# Altium schematic sheet fpga21-serdes-power.SchDoc
size Tabloid; SheetNumber: 50; SheetTotal: 71
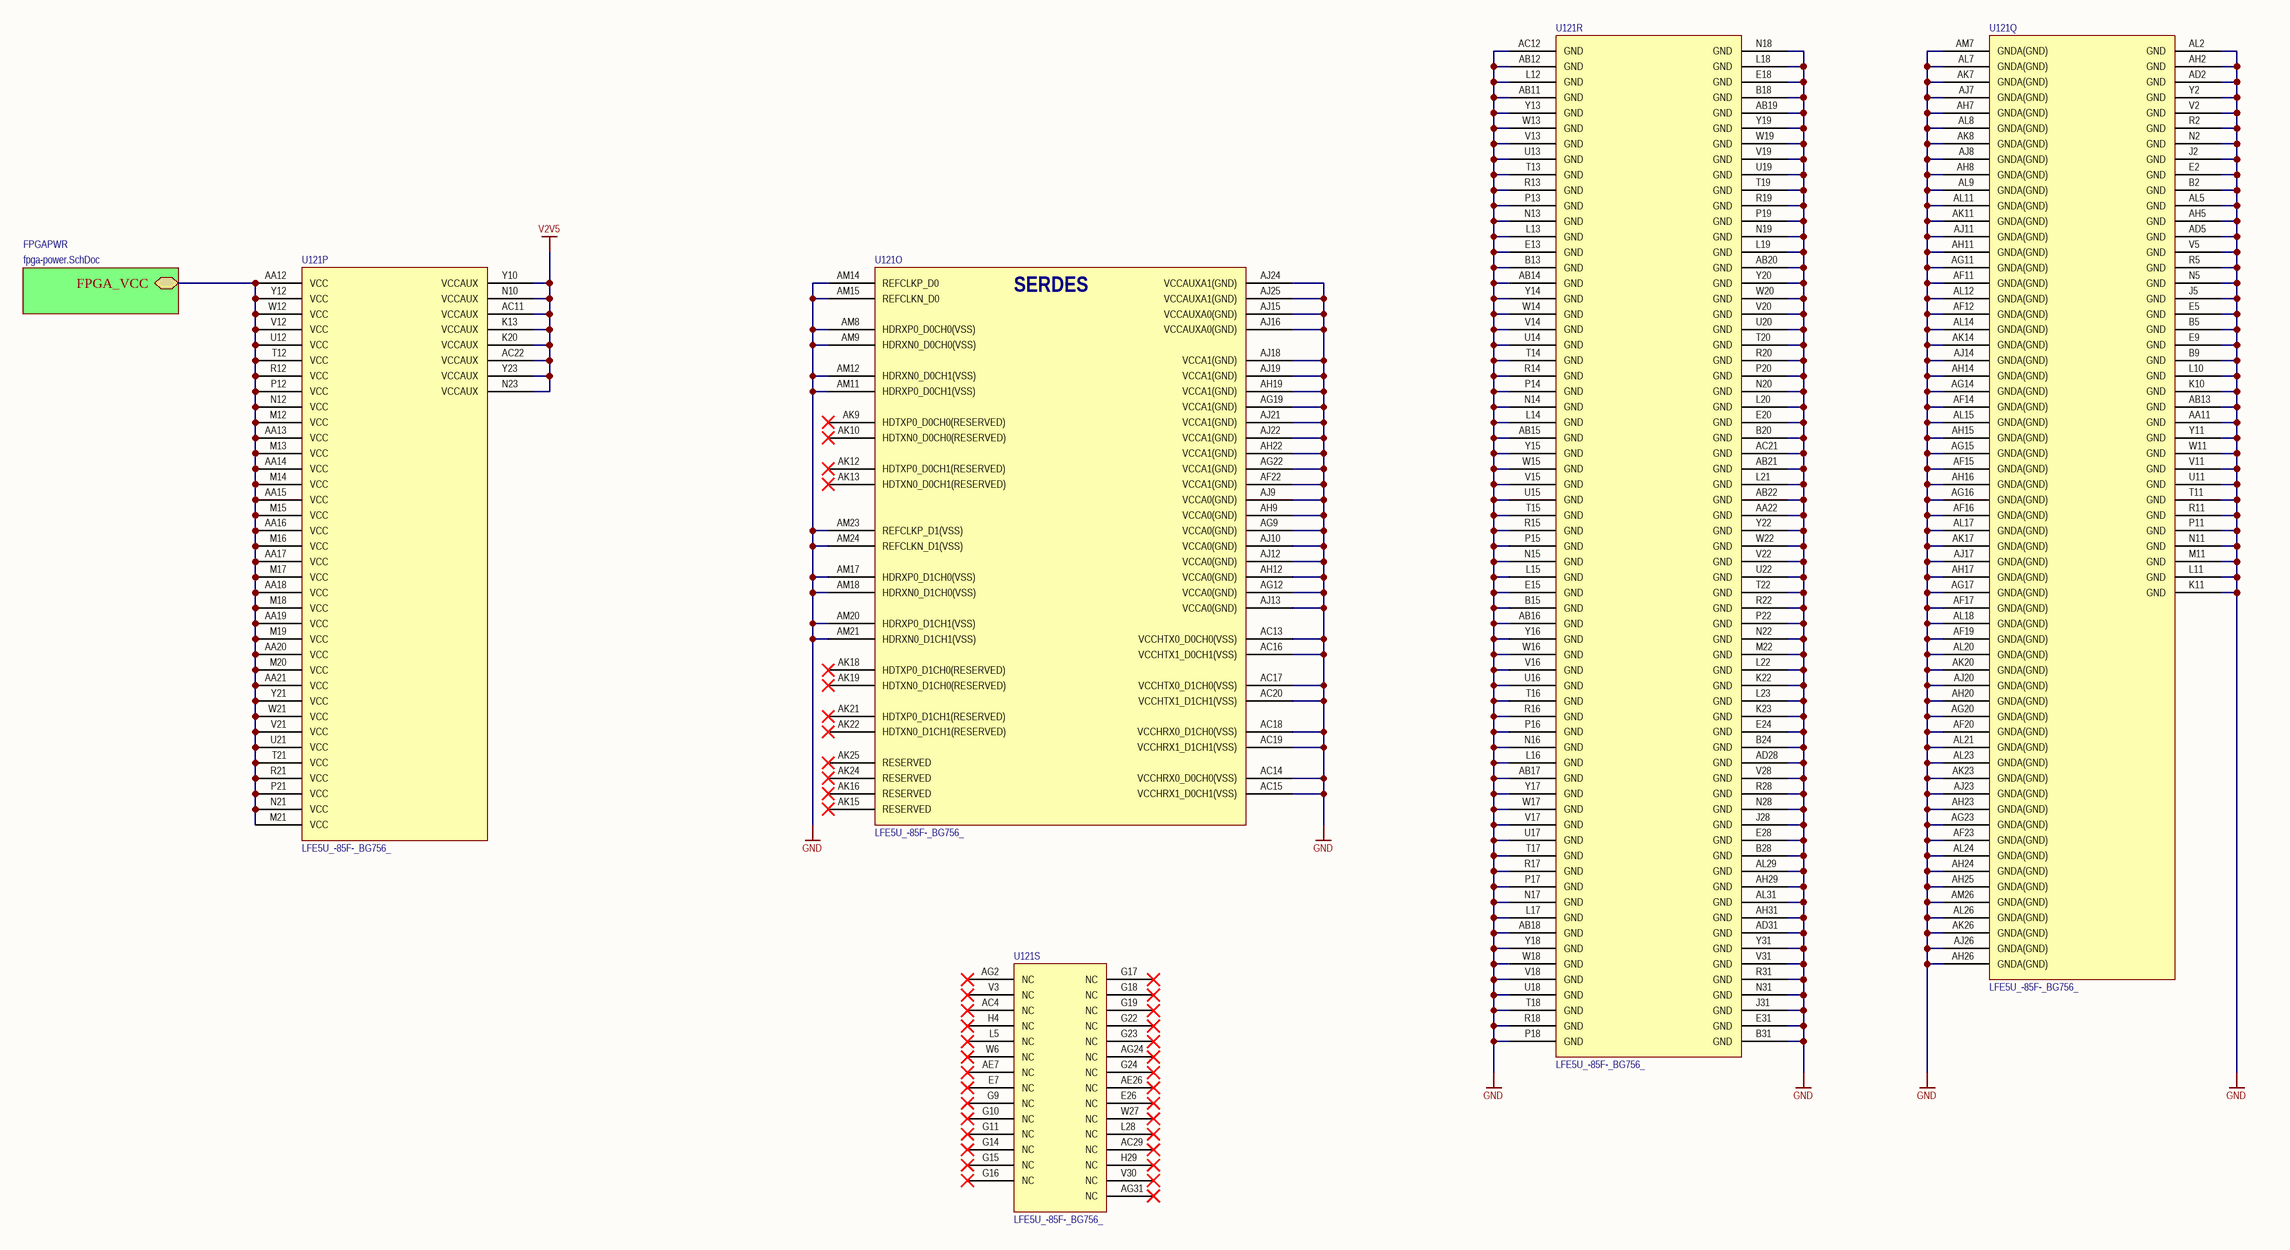
[diagram p0: fpga21-serdes-power.SchDoc]

## Parts
U121  LFE5U_-85F-_BG756_  [caBGA756]  (parts O,P,Q,R,S of 19)

## Sub-sheets
FPGAPWR = fpga-power.SchDoc: FPGA_VCC

## Nets
GND: U121.AA11(GND) U121.AA22(GND) U121.AB11(GND) U121.AB12(GND) U121.AB13(GND) U121.AB14(GND) U121.AB15(GND) U121.AB16(GND) U121.AB17(GND) U121.AB18(GND) U121.AB19(GND) U121.AB20(GND) U121.AB21(GND) U121.AB22(GND) U121.AC12(GND) U121.AC13(VCCHTX0_D0CH0(VSS)) U121.AC14(VCCHRX0_D0CH0(VSS)) U121.AC15(VCCHRX1_D0CH1(VSS)) U121.AC16(VCCHTX1_D0CH1(VSS)) U121.AC17(VCCHTX0_D1CH0(VSS)) U121.AC18(VCCHRX0_D1CH0(VSS)) U121.AC19(VCCHRX1_D1CH1(VSS)) U121.AC20(VCCHTX1_D1CH1(VSS)) U121.AC21(GND) U121.AD2(GND) U121.AD5(GND) U121.AD28(GND) U121.AD31(GND) U121.AF11(GNDA(GND)) U121.AF12(GNDA(GND)) U121.AF14(GNDA(GND)) U121.AF15(GNDA(GND)) U121.AF16(GNDA(GND)) U121.AF17(GNDA(GND)) U121.AF19(GNDA(GND)) U121.AF20(GNDA(GND)) U121.AF22(VCCA1(GND)) U121.AF23(GNDA(GND)) U121.AG9(VCCA0(GND)) U121.AG11(GNDA(GND)) U121.AG12(VCCA0(GND)) U121.AG14(GNDA(GND)) U121.AG15(GNDA(GND)) U121.AG16(GNDA(GND)) U121.AG17(GNDA(GND)) U121.AG19(VCCA1(GND)) U121.AG20(GNDA(GND)) U121.AG22(VCCA1(GND)) U121.AG23(GNDA(GND)) U121.AH2(GND) U121.AH5(GND) U121.AH7(GNDA(GND)) U121.AH8(GNDA(GND)) U121.AH9(VCCA0(GND)) U121.AH11(GNDA(GND)) U121.AH12(VCCA0(GND)) U121.AH14(GNDA(GND)) U121.AH15(GNDA(GND)) U121.AH16(GNDA(GND)) U121.AH17(GNDA(GND)) U121.AH19(VCCA1(GND)) U121.AH20(GNDA(GND)) U121.AH22(VCCA1(GND)) U121.AH23(GNDA(GND)) U121.AH24(GNDA(GND)) U121.AH25(GNDA(GND)) U121.AH26(GNDA(GND)) U121.AH29(GND) U121.AH31(GND) U121.AJ7(GNDA(GND)) U121.AJ8(GNDA(GND)) U121.AJ9(VCCA0(GND)) U121.AJ10(VCCA0(GND)) U121.AJ11(GNDA(GND)) U121.AJ12(VCCA0(GND)) U121.AJ13(VCCA0(GND)) U121.AJ14(GNDA(GND)) U121.AJ15(VCCAUXA0(GND)) U121.AJ16(VCCAUXA0(GND)) U121.AJ17(GNDA(GND)) U121.AJ18(VCCA1(GND)) U121.AJ19(VCCA1(GND)) U121.AJ20(GNDA(GND)) U121.AJ21(VCCA1(GND)) U121.AJ22(VCCA1(GND)) U121.AJ23(GNDA(GND)) U121.AJ24(VCCAUXA1(GND)) U121.AJ25(VCCAUXA1(GND)) U121.AJ26(GNDA(GND)) U121.AK7(GNDA(GND)) U121.AK8(GNDA(GND)) U121.AK11(GNDA(GND)) U121.AK14(GNDA(GND)) U121.AK17(GNDA(GND)) U121.AK20(GNDA(GND)) U121.AK23(GNDA(GND)) U121.AK26(GNDA(GND)) U121.AL2(GND) U121.AL5(GND) U121.AL7(GNDA(GND)) U121.AL8(GNDA(GND)) U121.AL9(GNDA(GND)) U121.AL11(GNDA(GND)) U121.AL12(GNDA(GND)) U121.AL14(GNDA(GND)) U121.AL15(GNDA(GND)) U121.AL17(GNDA(GND)) U121.AL18(GNDA(GND)) U121.AL20(GNDA(GND)) U121.AL21(GNDA(GND)) U121.AL23(GNDA(GND)) U121.AL24(GNDA(GND)) U121.AL26(GNDA(GND)) U121.AL29(GND) U121.AL31(GND) U121.AM7(GNDA(GND)) U121.AM8(HDRXP0_D0CH0(VSS)) U121.AM9(HDRXN0_D0CH0(VSS)) U121.AM11(HDRXP0_D0CH1(VSS)) U121.AM12(HDRXN0_D0CH1(VSS)) U121.AM14(REFCLKP_D0) U121.AM15(REFCLKN_D0) U121.AM17(HDRXP0_D1CH0(VSS)) U121.AM18(HDRXN0_D1CH0(VSS)) U121.AM20(HDRXP0_D1CH1(VSS)) U121.AM21(HDRXN0_D1CH1(VSS)) U121.AM23(REFCLKP_D1(VSS)) U121.AM24(REFCLKN_D1(VSS)) U121.AM26(GNDA(GND)) U121.B2(GND) U121.B5(GND) U121.B9(GND) U121.B13(GND) U121.B15(GND) U121.B18(GND) U121.B20(GND) U121.B24(GND) U121.B28(GND) U121.B31(GND) U121.E2(GND) U121.E5(GND) U121.E9(GND) U121.E13(GND) U121.E15(GND) U121.E18(GND) U121.E20(GND) U121.E24(GND) U121.E28(GND) U121.E31(GND) U121.J2(GND) U121.J5(GND) U121.J28(GND) U121.J31(GND) U121.K10(GND) U121.K11(GND) U121.K22(GND) U121.K23(GND) U121.L10(GND) U121.L11(GND) U121.L12(GND) U121.L13(GND) U121.L14(GND) U121.L15(GND) U121.L16(GND) U121.L17(GND) U121.L18(GND) U121.L19(GND) U121.L20(GND) U121.L21(GND) U121.L22(GND) U121.L23(GND) U121.M11(GND) U121.M22(GND) U121.N2(GND) U121.N5(GND) U121.N11(GND) U121.N13(GND) U121.N14(GND) U121.N15(GND) U121.N16(GND) U121.N17(GND) U121.N18(GND) U121.N19(GND) U121.N20(GND) U121.N22(GND) U121.N28(GND) U121.N31(GND) U121.P11(GND) U121.P13(GND) U121.P14(GND) U121.P15(GND) U121.P16(GND) U121.P17(GND) U121.P18(GND) U121.P19(GND) U121.P20(GND) U121.P22(GND) U121.R2(GND) U121.R5(GND) U121.R11(GND) U121.R13(GND) U121.R14(GND) U121.R15(GND) U121.R16(GND) U121.R17(GND) U121.R18(GND) U121.R19(GND) U121.R20(GND) U121.R22(GND) U121.R28(GND) U121.R31(GND) U121.T11(GND) U121.T13(GND) U121.T14(GND) U121.T15(GND) U121.T16(GND) U121.T17(GND) U121.T18(GND) U121.T19(GND) U121.T20(GND) U121.T22(GND) U121.U11(GND) U121.U13(GND) U121.U14(GND) U121.U15(GND) U121.U16(GND) U121.U17(GND) U121.U18(GND) U121.U19(GND) U121.U20(GND) U121.U22(GND) U121.V2(GND) U121.V5(GND) U121.V11(GND) U121.V13(GND) U121.V14(GND) U121.V15(GND) U121.V16(GND) U121.V17(GND) U121.V18(GND) U121.V19(GND) U121.V20(GND) U121.V22(GND) U121.V28(GND) U121.V31(GND) U121.W11(GND) U121.W13(GND) U121.W14(GND) U121.W15(GND) U121.W16(GND) U121.W17(GND) U121.W18(GND) U121.W19(GND) U121.W20(GND) U121.W22(GND) U121.Y2(GND) U121.Y11(GND) U121.Y13(GND) U121.Y14(GND) U121.Y15(GND) U121.Y16(GND) U121.Y17(GND) U121.Y18(GND) U121.Y19(GND) U121.Y20(GND) U121.Y22(GND) U121.Y31(GND)
V2V5: U121.AC11(VCCAUX) U121.AC22(VCCAUX) U121.K13(VCCAUX) U121.K20(VCCAUX) U121.N10(VCCAUX) U121.N23(VCCAUX) U121.Y10(VCCAUX) U121.Y23(VCCAUX)
NetU121_AA12: U121.AA12(VCC) U121.AA13(VCC) U121.AA14(VCC) U121.AA15(VCC) U121.AA16(VCC) U121.AA17(VCC) U121.AA18(VCC) U121.AA19(VCC) U121.AA20(VCC) U121.AA21(VCC) U121.M12(VCC) U121.M13(VCC) U121.M14(VCC) U121.M15(VCC) U121.M16(VCC) U121.M17(VCC) U121.M18(VCC) U121.M19(VCC) U121.M20(VCC) U121.M21(VCC) U121.N12(VCC) U121.N21(VCC) U121.P12(VCC) U121.P21(VCC) U121.R12(VCC) U121.R21(VCC) U121.T12(VCC) U121.T21(VCC) U121.U12(VCC) U121.U21(VCC) U121.V12(VCC) U121.V21(VCC) U121.W12(VCC) U121.W21(VCC) U121.Y12(VCC) U121.Y21(VCC) ; sheet FPGAPWR/FPGA_VCC

Not connected (* = marked no-connect by the designer): U121 AC4(NC)* AC29(NC)* AE7(NC)* AE26(NC)* AG2(NC)* AG24(NC)* AG31(NC)* AK9(HDTXP0_D0CH0(RESERVED))* AK10(HDTXN0_D0CH0(RESERVED))* AK12(HDTXP0_D0CH1(RESERVED))* AK13(HDTXN0_D0CH1(RESERVED))* AK15(RESERVED)* AK16(RESERVED)* AK18(HDTXP0_D1CH0(RESERVED))* AK19(HDTXN0_D1CH0(RESERVED))* AK21(HDTXP0_D1CH1(RESERVED))* AK22(HDTXN0_D1CH1(RESERVED))* AK24(RESERVED)* AK25(RESERVED)* E7(NC)* E26(NC)* G9(NC)* G10(NC)* G11(NC)* G14(NC)* G15(NC)* G16(NC)* G17(NC)* G18(NC)* G19(NC)* G22(NC)* G23(NC)* G24(NC)* H4(NC)* H29(NC)* L5(NC)* L28(NC)* V3(NC)* V30(NC)* W6(NC)* W27(NC)*

## Notes on the sheet
- (in symbol LFE5U_-85F-_BG756_, part O) SERDES

## Library data of the parts
U121 = LFE5U_-85F-_BG756_: ECP5 FPGA, 85k LUT, 756-caBGA; Manufacturer: Lattice Semiconductor; Manufacturer P/N: LFE5U_-85F-_BG756_